# EAGLE schematic ModbusScanner (EAGLE 7.7.0)
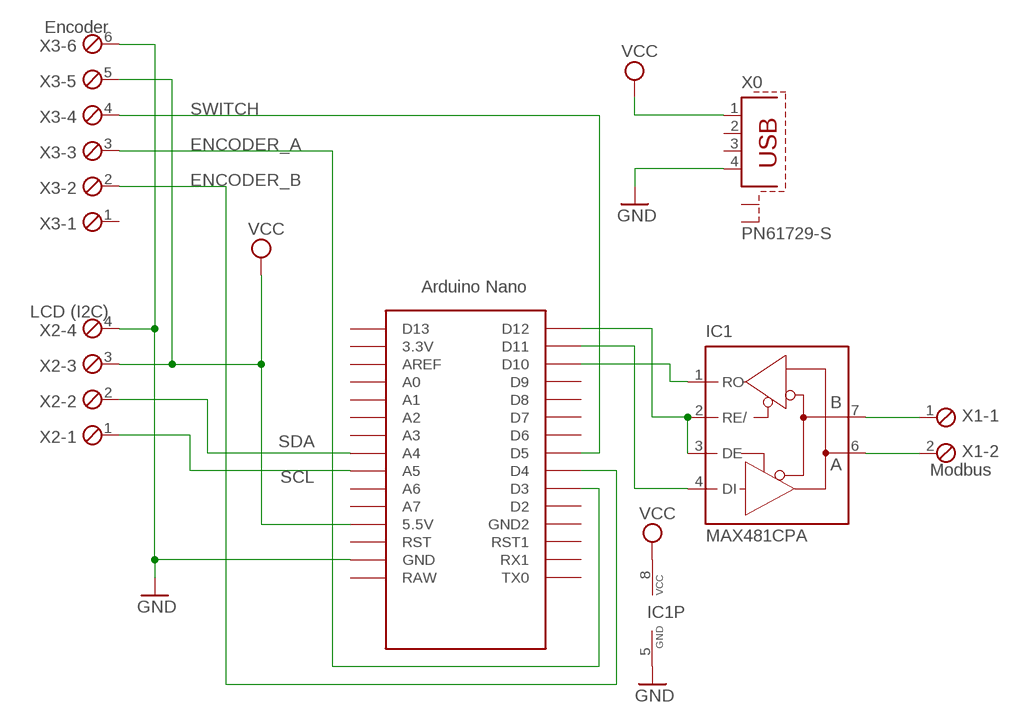
[diagram p0: schematic, sheet 1]

## Parts
IC1  MAX481CPA  [DIL08]
U$1  NANO  [NANO]
X0  PN61729-S  [PN61729-S]
X1  Modbus  MPT2  [2POL254]
X2  LCD (I2C)  MPT4  [4POL254]
X3  Encoder  MPT6  [6POL254]

## Nets
ENCODER_A: U$1.D3 X3.3
ENCODER_B: U$1.D4 X3.2
GND: IC1.5(GND) U$1.GND X0.4 X2.4 X3.6
N$1: IC1.1(RO) U$1.D10
N$2: IC1.4(DI) U$1.D11
N$3: IC1.2(RE/) IC1.3(DE) U$1.D12
N$4: IC1.7(B) X1.1
N$5: IC1.6(A) X1.2
SCL: U$1.A5 X2.1
SDA: U$1.A4 X2.2
SWITCH: U$1.D5 X3.4
VCC: IC1.8(VCC) U$1.5V(5.5V) X0.1 X2.3 X3.5
Unconnected: U$1.3.3V U$1.A0 U$1.A1 U$1.A2 U$1.A3 U$1.A6 U$1.A7 U$1.AREF U$1.D2 U$1.D6 U$1.D7 U$1.D8 U$1.D9 U$1.D13 U$1.GND1(GND2) U$1.ICSP1 U$1.ICSP2 U$1.ICSP3 U$1.ICSP4 U$1.ICSP5 U$1.ICSP6 U$1.RAW U$1.RST U$1.RST1 U$1.RX1 U$1.TX0 X0.2 X0.3 X0.S1 X0.S2 X3.1

## Library data of the parts
IC1 = maxim:MAX481CPA: RS485 TRANSEIVER; MPN: MAX481CPA+; OC_FARNELL: unknown; OC_NEWARK: 99K3445
U$1 = Arduino-clone:NANO: Arduino Nano
X0 = con-berg:PN61729-S: BERG USB connector; OC_FARNELL: unknown; OC_NEWARK: unknown
X1 = con-phoenix-254:MPT2: PHOENIX CONNECTOR; OC_FARNELL: unknown; OC_NEWARK: unknown
X2 = con-phoenix-254:MPT4: PHOENIX CONNECTOR; OC_FARNELL: unknown; OC_NEWARK: unknown
X3 = con-phoenix-254:MPT6: PHOENIX CONNECTOR; OC_FARNELL: unknown; OC_NEWARK: unknown